# Altium schematic sheet DDR3.schdoc
size 420 x 298 mm; Symbol: Sheet-Symbol_A4; Company: 嘉立创EDA; Version: V1.0; Page Size: A4; @Project Name: prj_extend_and_core_board; @Page Count: 7; @Update Date: 2024-06-14; @Create Date: 2024-05-07; @Schematic Name: Schematic1; @Page No: 3; @Page Name: DDR3; Device: Sheet-Symbol_A4
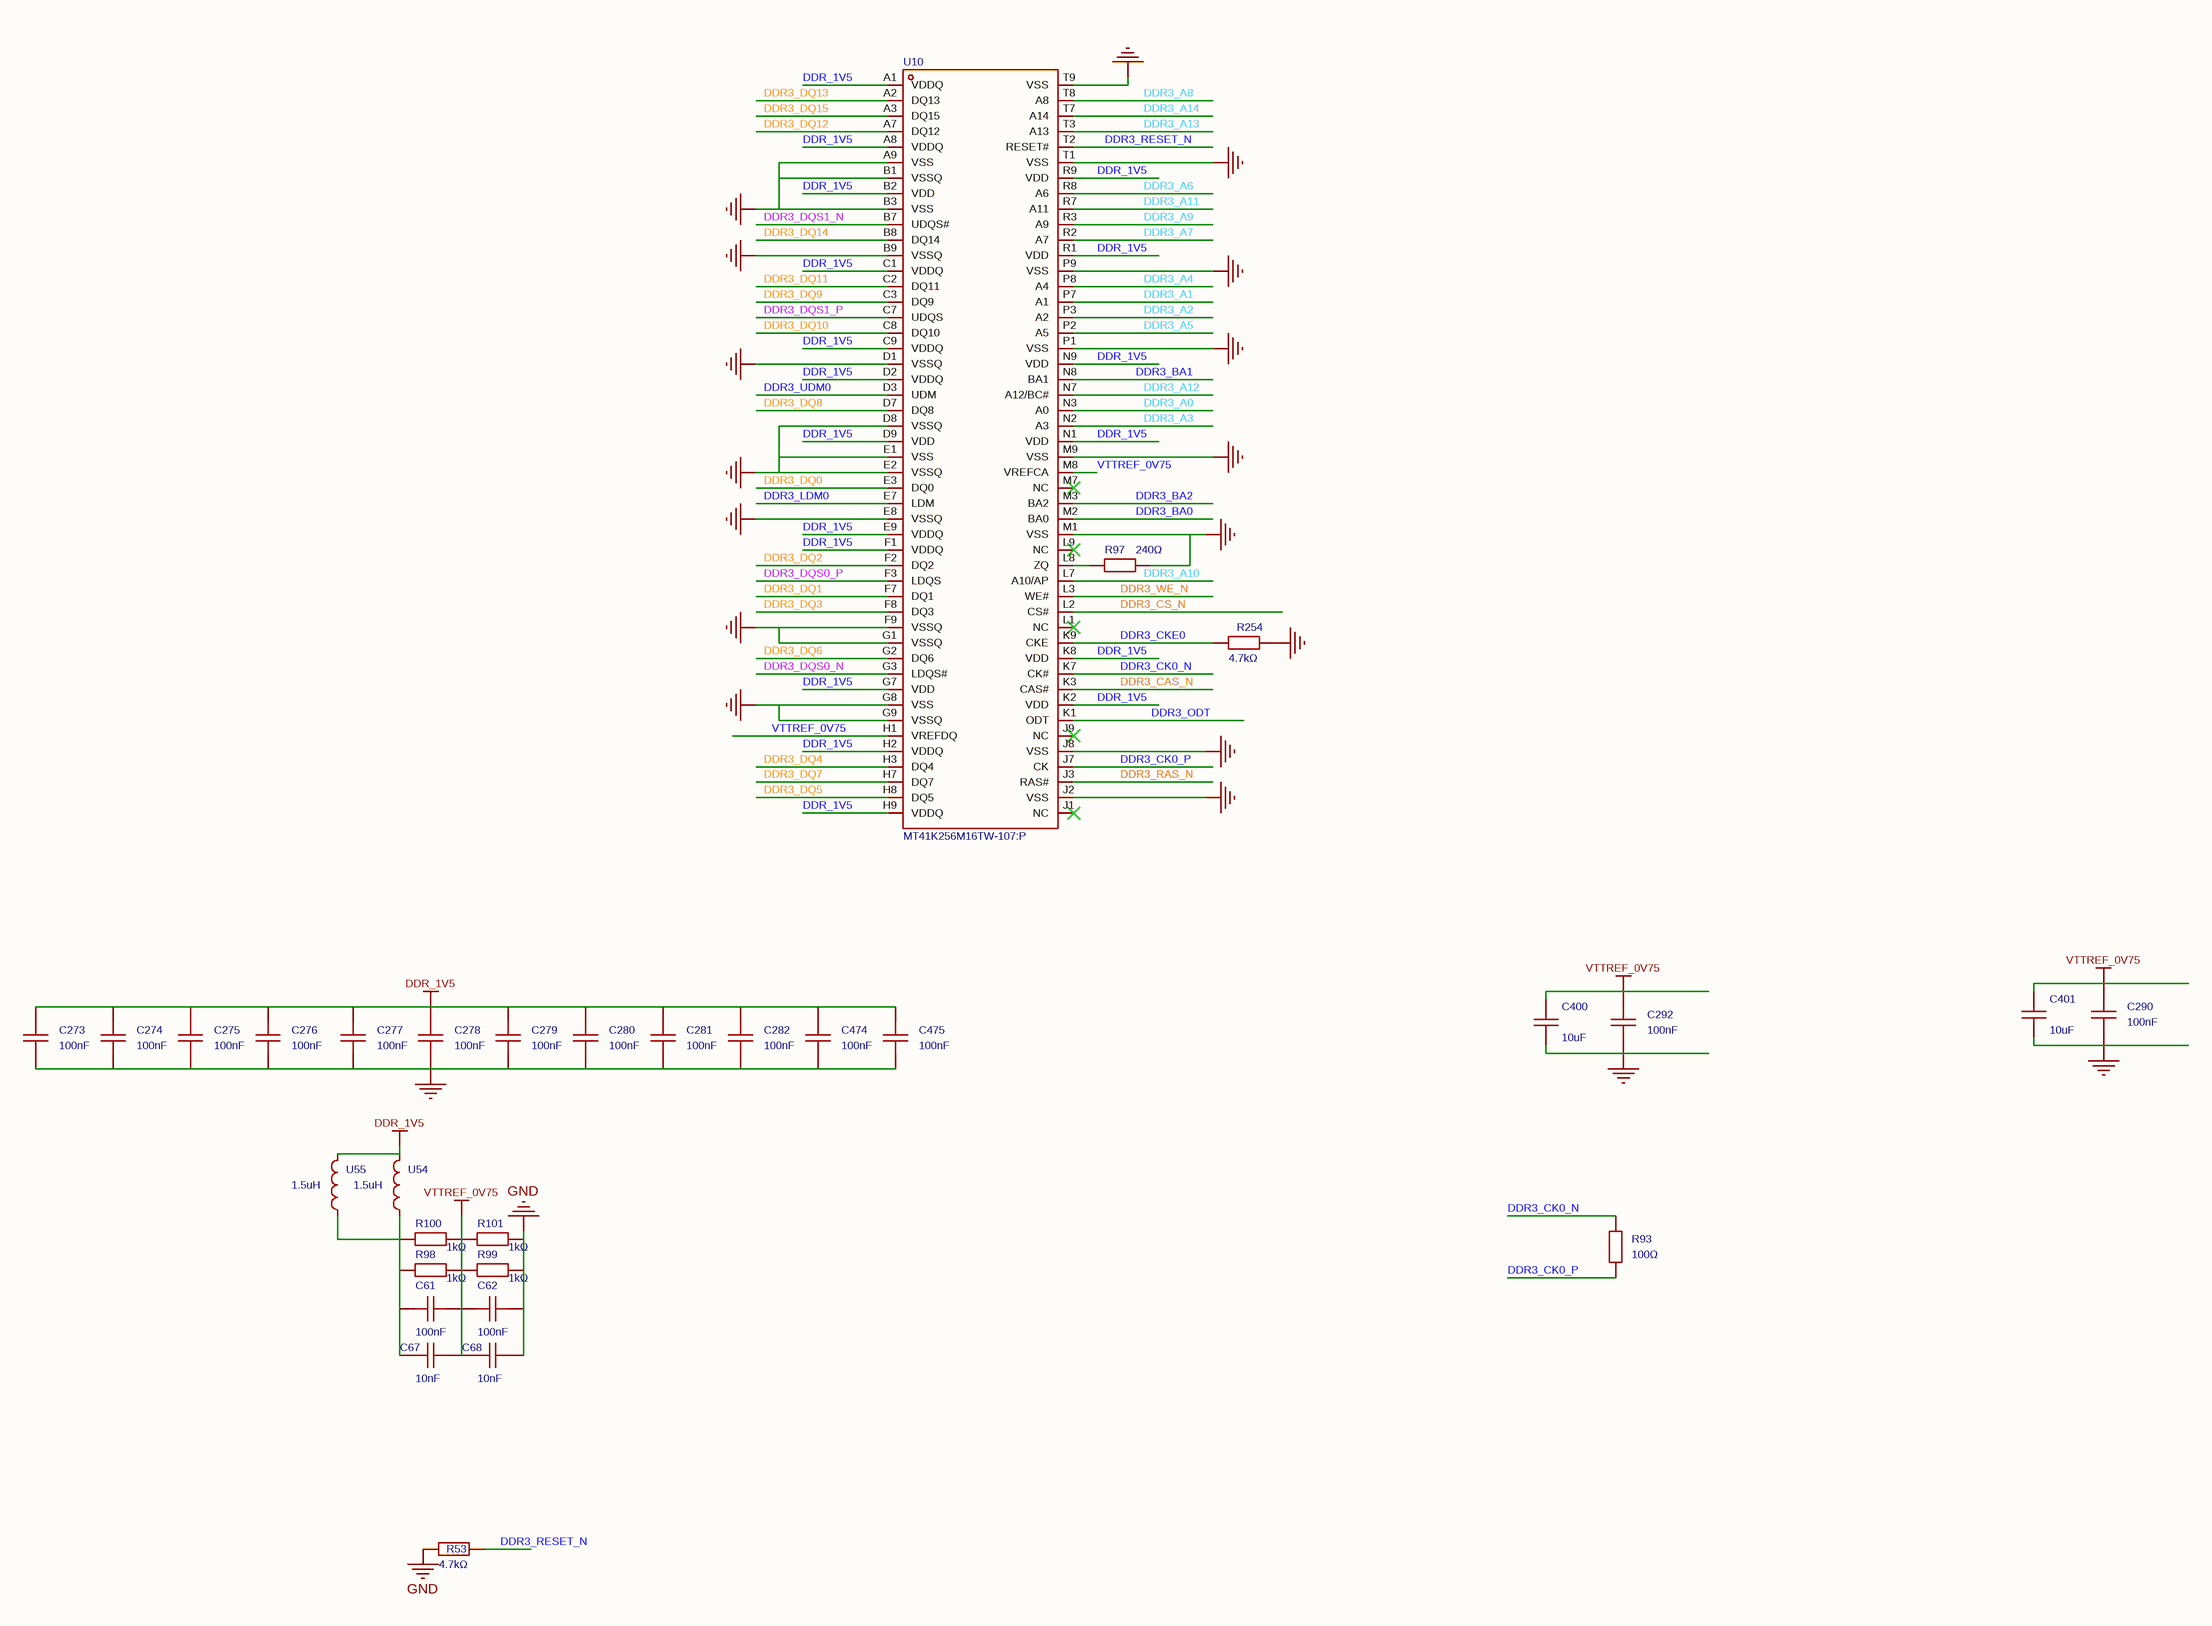
[diagram p0: DDR3.schdoc]

## Parts
C61  100nF  [C0402]
C62  100nF  [C0402]
C67  10nF  [C0402]
C68  10nF  [C0402]
C273  100nF  [C0402]
C274  100nF  [C0402]
C275  100nF  [C0402]
C276  100nF  [C0402]
C277  100nF  [C0402]
C278  100nF  [C0402]
C279  100nF  [C0402]
C280  100nF  [C0402]
C281  100nF  [C0402]
C282  100nF  [C0402]
C290  100nF  [C0402]
C292  100nF  [C0402]
C400  10uF  [C0402]
C401  10uF  [C0402]
C474  100nF  [C0402]
C475  100nF  [C0402]
R53  4.7kΩ  [R0402]
R93  100Ω  [R0603]
R97  240Ω  [R0402]
R98  1kΩ  [R0603]
R99  1kΩ  [R0603]
R100  1kΩ  [R0603]
R101  1kΩ  [R0603]
R254  4.7kΩ  [R0402]
U10  MT41K256M16TW-107:P  [FBGA-96_L14.0-W8.0-R16-C6-P0.80-TL]
U54  1.5uH  [L0603]
U55  1.5uH  [L0603]

## Nets
DDR_1V5: C273.2 C274.2 C275.2 C276.2 C277.2 C278.2 C279.2 C280.2 C281.2 C282.2 C474.2 C475.2 U10.A1(VDDQ) U10.A8(VDDQ) U10.B2(VDD) U10.C1(VDDQ) U10.C9(VDDQ) U10.D2(VDDQ) U10.D9(VDD) U10.E9(VDDQ) U10.F1(VDDQ) U10.G7(VDD) U10.H2(VDDQ) U10.H9(VDDQ) U10.K2(VDD) U10.K8(VDD) U10.N1(VDD) U10.N9(VDD) U10.R1(VDD) U10.R9(VDD) U54.2 U55.2
GND: C62.2 C68.2 C273.1 C274.1 C275.1 C276.1 C277.1 C278.1 C279.1 C280.1 C281.1 C282.1 C290.1 C292.1 C400.1 C401.1 C474.1 C475.1 R53.1 R97.2 R99.2 R101.2 R254.2 U10.A9(VSS) U10.B1(VSSQ) U10.B3(VSS) U10.B9(VSSQ) U10.D1(VSSQ) U10.D8(VSSQ) U10.E1(VSS) U10.E2(VSSQ) U10.E8(VSSQ) U10.F9(VSSQ) U10.G1(VSSQ) U10.G8(VSS) U10.G9(VSSQ) U10.J2(VSS) U10.J8(VSS) U10.M1(VSS) U10.M9(VSS) U10.P1(VSS) U10.P9(VSS) U10.T1(VSS) U10.T9(VSS)
VTTREF_0V75: C61.2 C62.1 C67.2 C68.1 C290.2 C292.2 C400.2 C401.2 R98.2 R99.1 R100.2 R101.1 U10.H1(VREFDQ) U10.M8(VREFCA)
DDR3_A0: U10.N3(A0)
DDR3_A1: U10.P7(A1)
DDR3_A2: U10.P3(A2)
DDR3_A3: U10.N2(A3)
DDR3_A4: U10.P8(A4)
DDR3_A5: U10.P2(A5)
DDR3_A6: U10.R8(A6)
DDR3_A7: U10.R2(A7)
DDR3_A8: U10.T8(A8)
DDR3_A9: U10.R3(A9)
DDR3_A10: U10.L7(A10/AP)
DDR3_A11: U10.R7(A11)
DDR3_A12: U10.N7(A12/BC#)
DDR3_A13: U10.T3(A13)
DDR3_A14: U10.T7(A14)
DDR3_BA0: U10.M2(BA0)
DDR3_BA1: U10.N8(BA1)
DDR3_BA2: U10.M3(BA2)
DDR3_CAS_N: U10.K3(CAS#)
DDR3_CK0_N: R93.2 U10.K7(CK#)
DDR3_CK0_P: R93.1 U10.J7(CK)
DDR3_CKE0: R254.1 U10.K9(CKE)
DDR3_CS_N: U10.L2(CS#)
DDR3_DQ0: U10.E3(DQ0)
DDR3_DQ1: U10.F7(DQ1)
DDR3_DQ2: U10.F2(DQ2)
DDR3_DQ3: U10.F8(DQ3)
DDR3_DQ4: U10.H3(DQ4)
DDR3_DQ5: U10.H8(DQ5)
DDR3_DQ6: U10.G2(DQ6)
DDR3_DQ7: U10.H7(DQ7)
DDR3_DQ8: U10.D7(DQ8)
DDR3_DQ9: U10.C3(DQ9)
DDR3_DQ10: U10.C8(DQ10)
DDR3_DQ11: U10.C2(DQ11)
DDR3_DQ12: U10.A7(DQ12)
DDR3_DQ13: U10.A2(DQ13)
DDR3_DQ14: U10.B8(DQ14)
DDR3_DQ15: U10.A3(DQ15)
DDR3_DQS0_N: U10.G3(LDQS#)
DDR3_DQS0_P: U10.F3(LDQS)
DDR3_DQS1_N: U10.B7(UDQS#)
DDR3_DQS1_P: U10.C7(UDQS)
DDR3_LDM0: U10.E7(LDM)
DDR3_ODT: U10.K1(ODT)
DDR3_RAS_N: U10.J3(RAS#)
DDR3_RESET_N: R53.2 U10.T2(RESET#)
DDR3_UDM0: U10.D3(UDM)
DDR3_WE_N: U10.L3(WE#)
NetC61_1: C61.1 C67.1 R98.1 R100.1 U54.1 U55.1
NetR97_1: R97.1 U10.L8(ZQ)

Not connected (* = marked no-connect by the designer): U10 J1(NC)* J9(NC)* L1(NC)* L9(NC)* M7(NC)*

## Notes on the sheet
- 1
- 2
- 3
- 4
- 5
- 6
- A
- B
- C
- 更新日期
- 2024-06-14
- D
- 原理图
- 图页
- Schematic1
- DDR3
- 创建日期
- 物料编码
- 2024-05-07
- 审阅
- 绘制
- prj_extend_and_core_board
- 版本
- V1.0
- 尺寸
- A4
- 页
- 嘉立创EDA
- 共
- 7

## Library data of the parts
C61 C62 = 0402B104K500NT: 容值:100nF;精度:±10%;额定电压:50V;材质(温度系数):X7R;; Manufacturer: FH(风华); Symbol: CapAcitance; AddInBom: yes; ModelId: 36a51122f27c49738f86b3bfa98863e0; ModelName: C0402_L1.0-W0.5-H0.5; ModelTransform: 39.37,19.685,0,0,0,0,0,0,0; Tolerance: ±10%; Voltage Rated: 50V; Temperature Coefficient: X7R; Device: 0402B104K500NT; LCSC Part Name: 100nF ±10% 50V; SupplierPart: C110251; ManufacturerPart: 0402B104K500NT; Supplier Footprint: 0402; JLCPCB Part Class: Extended Part; Datasheet: https://atta.szlcsc.com/upload/public/pdf/source/20200305/C486355_26A10D38EF8C2A5C37091D0039909270.pdf; Supplier: LCSC; ConvertToPcb: yes; FootprintName: C0402; Value: 100nF
C67 C68 = CC0402KRX7R9BB103: 容值:10nF;精度:±10%;额定电压:50V;材质(温度系数):X7R;; Manufacturer: YAGEO(国巨); Symbol: CapAcitance; AddInBom: yes; ModelId: 36a51122f27c49738f86b3bfa98863e0; ModelName: C0402_L1.0-W0.5-H0.5; ModelTransform: 39.37,19.685,0,0,0,0,0,0,0; Tolerance: ±10%; Voltage Rated: 50V; Temperature Coefficient: X7R; Value: 10nF; Device: CC0402KRX7R9BB103; JLCPCB Part Class: Extended Part; LCSC Part Name: 10nF ±10% 50V; SupplierPart: C60133; ManufacturerPart: CC0402KRX7R9BB103; Supplier Footprint: 0402; Datasheet: https://atta.szlcsc.com/upload/public/pdf/source/20180224/C181747_15194369449651363981.pdf; Supplier: LCSC; ConvertToPcb: yes; FootprintName: C0402
C273-C282 C290 C292 C474 C475 = CL05B104KB54PNC: 容值:100nF;精度:±10%;额定电压:50V;材质(温度系数):X7R;; Manufacturer: SAMSUNG(三星); AddInBom: yes; ModelId: 36a51122f27c49738f86b3bfa98863e0; ModelName: C0402_L1.0-W0.5-H0.5; ModelTransform: 39.37,19.685,0,0,0,0,0,0,0; Tolerance: ±10%; Voltage Rated: 50V; Temperature Coefficient: X7R; Symbol: CL05B104KB54PNC; Device: CL05B104KB54PNC; LCSC Part Name: 100nF ±10% 50V; SupplierPart: C307331; ManufacturerPart: CL05B104KB54PNC; Supplier Footprint: 0402; JLCPCB Part Class: 基础库; Datasheet: https://atta.szlcsc.com/upload/public/pdf/source/20160218/1457707763339.pdf; Supplier: LCSC; ConvertToPcb: yes; FootprintName: C0402; Value: 100nF
C400 C401 = CL05A106MQ5NUNC: 容值:10uF;精度:±20%;额定电压:6.3V;材质(温度系数):X5R;; Manufacturer: SAMSUNG(三星); AddInBom: yes; ModelId: 36a51122f27c49738f86b3bfa98863e0; ModelName: C0402_L1.0-W0.5-H0.5; ModelTransform: 39.37,19.685,0,0,0,0,0,0,0; Tolerance: ±20%; Voltage Rated: 6.3V; Temperature Coefficient: X5R; Symbol: CL05A106MQ5NUNC; Device: CL05A106MQ5NUNC; Supplier: LCSC; Manufacturer Part: CL05A106MQ5NUNC; Value: 10uF; Supplier Part: C15525; JLCPCB Part Class: 基础库; LCSC Part Name: 10uF ±20% 6.3V; Supplier Footprint: 0402; Datasheet: https://atta.szlcsc.com/upload/public/pdf/source/20220823/2B02EE04F8F211D38A52DCB16EB6BEBA.pdf; ConvertToPcb: yes; FootprintName: C0402
R53 R254 = 0402WGF4701TCE: 电阻类型:厚膜电阻;阻值:4.7kΩ;精度:±1%;功率:62.5mW;最大工作电压:50V;温度系数:±100ppm/℃;; Manufacturer: UNI-ROYAL(厚声); Symbol: 电阻; AddInBom: yes; ModelId: 671aefced39d4c318694bba8bd8efd39; ModelName: R0402_L1.0-W0.5-H0.5; ModelTransform: 39.37,19.685,0,0,0,0,0,0.0005,0; Tolerance: ±1%; Power(Watts): 62.5mW; Overload Voltage (Max): 50V; Value: 4.7kΩ; Device: 0402WGF4701TCE; JLCPCB Part Class: Basic Part; LCSC Part Name: 4.7kΩ ±1% 62.5mW 厚膜电阻; SupplierPart: C25900; ManufacturerPart: 0402WGF4701TCE; Supplier Footprint: 0402; Datasheet: https://atta.szlcsc.com/upload/public/pdf/source/20200306/C422600_1E6D84923E4A46A82E41ADD87F860B5C.pdf; Supplier: LCSC; ConvertToPcb: yes; FootprintName: R0402; Type: 厚膜电阻; Temperature Coefficient: ±100ppm/℃; Operating Temperature Range: -55℃~+155℃
R93 = RT0603BRD07100RL: 电阻类型:薄膜电阻;阻值:100Ω;精度:±0.1%;功率:100mW;最大工作电压:75V;温度系数:±25ppm/℃;; Manufacturer: YAGEO(国巨); AddInBom: yes; ModelId: fc143cca1e79419f9cd78b61e9279f08; ModelTransform: 31.8897,63.7794,0,90,0,0,0,0,0; Tolerance: ±0.1%; Power(Watts): 100mW; Overload Voltage (Max): 75V; Symbol: RT0603BRD07100RL; Device: RT0603BRD07100RL; LCSC Part Name: 薄膜电阻 100Ω ±0.1% 100mW; SupplierPart: C122970; ManufacturerPart: RT0603BRD07100RL; Supplier Footprint: 0603; JLCPCB Part Class: 扩展库; Datasheet: https://atta.szlcsc.com/upload/public/pdf/source/20180716/C95646_694A11296E8D6C27B0592E54BC4097D1.pdf; Supplier: LCSC; ConvertToPcb: yes; FootprintName: R0603; ModelName: R0603; Type: 薄膜电阻; Value: 100Ω; Temperature Coefficient: ±25ppm/℃; Operating Temperature Range: -55℃~+155℃
R97 = 0402WGF2400TCE: 电阻类型:厚膜电阻;阻值:240Ω;精度:±1%;功率:62.5mW;最大工作电压:50V;温度系数:±100ppm/℃;; Manufacturer: UNI-ROYAL(厚声); AddInBom: yes; ModelId: 671aefced39d4c318694bba8bd8efd39; ModelName: R0402_L1.0-W0.5-H0.5; ModelTransform: 39.37,19.685,0,0,0,0,0,0.0005,0; Tolerance: ±1%; Power(Watts): 62.5mW; Overload Voltage (Max): 50V; Symbol: 0402WGF2400TCE; Device: 0402WGF2400TCE; Supplier: LCSC; Manufacturer Part: 0402WGF2400TCE; Supplier Part: C25094; Value: 240Ω; JLCPCB Part Class: 扩展库; LCSC Part Name: 240Ω ±1% 62.5mW 厚膜电阻; Supplier Footprint: 0402; Datasheet: https://atta.szlcsc.com/upload/public/pdf/source/20200306/C422600_1E6D84923E4A46A82E41ADD87F860B5C.pdf; ConvertToPcb: yes; FootprintName: R0402; Type: 厚膜电阻; Temperature Coefficient: ±100ppm/℃; Operating Temperature Range: -55℃~+155℃
R98-R101 = RT0603BRD071KL: 电阻类型:薄膜电阻;阻值:1kΩ;精度:±0.1%;功率:100mW;最大工作电压:75V;温度系数:±25ppm/℃;; Manufacturer: YAGEO(国巨); AddInBom: yes; ModelId: fc143cca1e79419f9cd78b61e9279f08; ModelTransform: 31.8897,63.7794,0,90,0,0,0,0,0; Tolerance: ±0.1%; Power(Watts): 100mW; Overload Voltage (Max): 75V; Symbol: RT0603BRD071KL; Device: RT0603BRD071KL; LCSC Part Name: 薄膜电阻 1kΩ ±0.1% 100mW; SupplierPart: C110776; ManufacturerPart: RT0603BRD071KL; Supplier Footprint: 0603; JLCPCB Part Class: 扩展库; Datasheet: https://atta.szlcsc.com/upload/public/pdf/source/20170704/1499151282044.pdf; Supplier: LCSC; ConvertToPcb: yes; FootprintName: R0603; ModelName: R0603; Type: 薄膜电阻; Value: 1kΩ; Temperature Coefficient: ±25ppm/℃; Operating Temperature Range: -55℃~+155℃
U10 = MT41K256M16TW-107:P: 商业级; Manufacturer: micron(镁光); AddInBom: yes; ModelId: 09c921600e1b4bd985a2e4282350750e; ModelName: FBGA-96_L14.0-W8.0-H1.1-P0.8; ModelTransform: 314.96,551.18,0,0,0,0,0,0,0; Symbol: MT41K256M16TW-107:P; Device: MT41K256M16TW-107:P; Supplier: LCSC; Supplier Part: C253882; Manufacturer Part: MT41K256M16TW-107:P; JLCPCB Part Class: 扩展库; LCSC Part Name: MT41K256M16TW-107:PTR; Supplier Footprint: TFBGA-96; Datasheet: https://atta.szlcsc.com/upload/public/pdf/source/20190702/C253882_073A45851B86D33155EFFA955E523761.pdf; ConvertToPcb: yes; FootprintName: FBGA-96_L14.0-W8.0-R16-C6-P0.80-TL
U54 U55 = CMH160808B1R5MT: 电感值:1.5uH;精度:±20%;额定电流:-;饱和电流(Isat):-;类型:-;; Manufacturer: FH(风华); AddInBom: yes; ModelId: 2bc5ec593d464d6ba9807aec0b5673c2; ModelName: L0603_L1.6-W0.8-H0.5_BEAD; ModelTransform: 62.992,31.496,0,180,0,0,0.094,0.629,0; Tolerance: ±20%; Symbol: CMH160808B1R5MT; Device: CMH160808B1R5MT; LCSC Part Name: 1.5uH ±20%; SupplierPart: C3032607; ManufacturerPart: CMH160808B1R5MT; Supplier Footprint: 0603; JLCPCB Part Class: 扩展库; Datasheet: https://atta.szlcsc.com/upload/public/pdf/source/20191023/C394952_170C064090344AFF14D5ACCE4EB10000.pdf; Supplier: LCSC; ConvertToPcb: yes; FootprintName: L0603; Value: 1.5uH; Rated Current: -; Saturation Current (Isat): -; DC Resistance (DCR): -; Type: -; Ratings: AEC-Q200